# EAGLE design soar_demise (EAGLE 9.6.2)
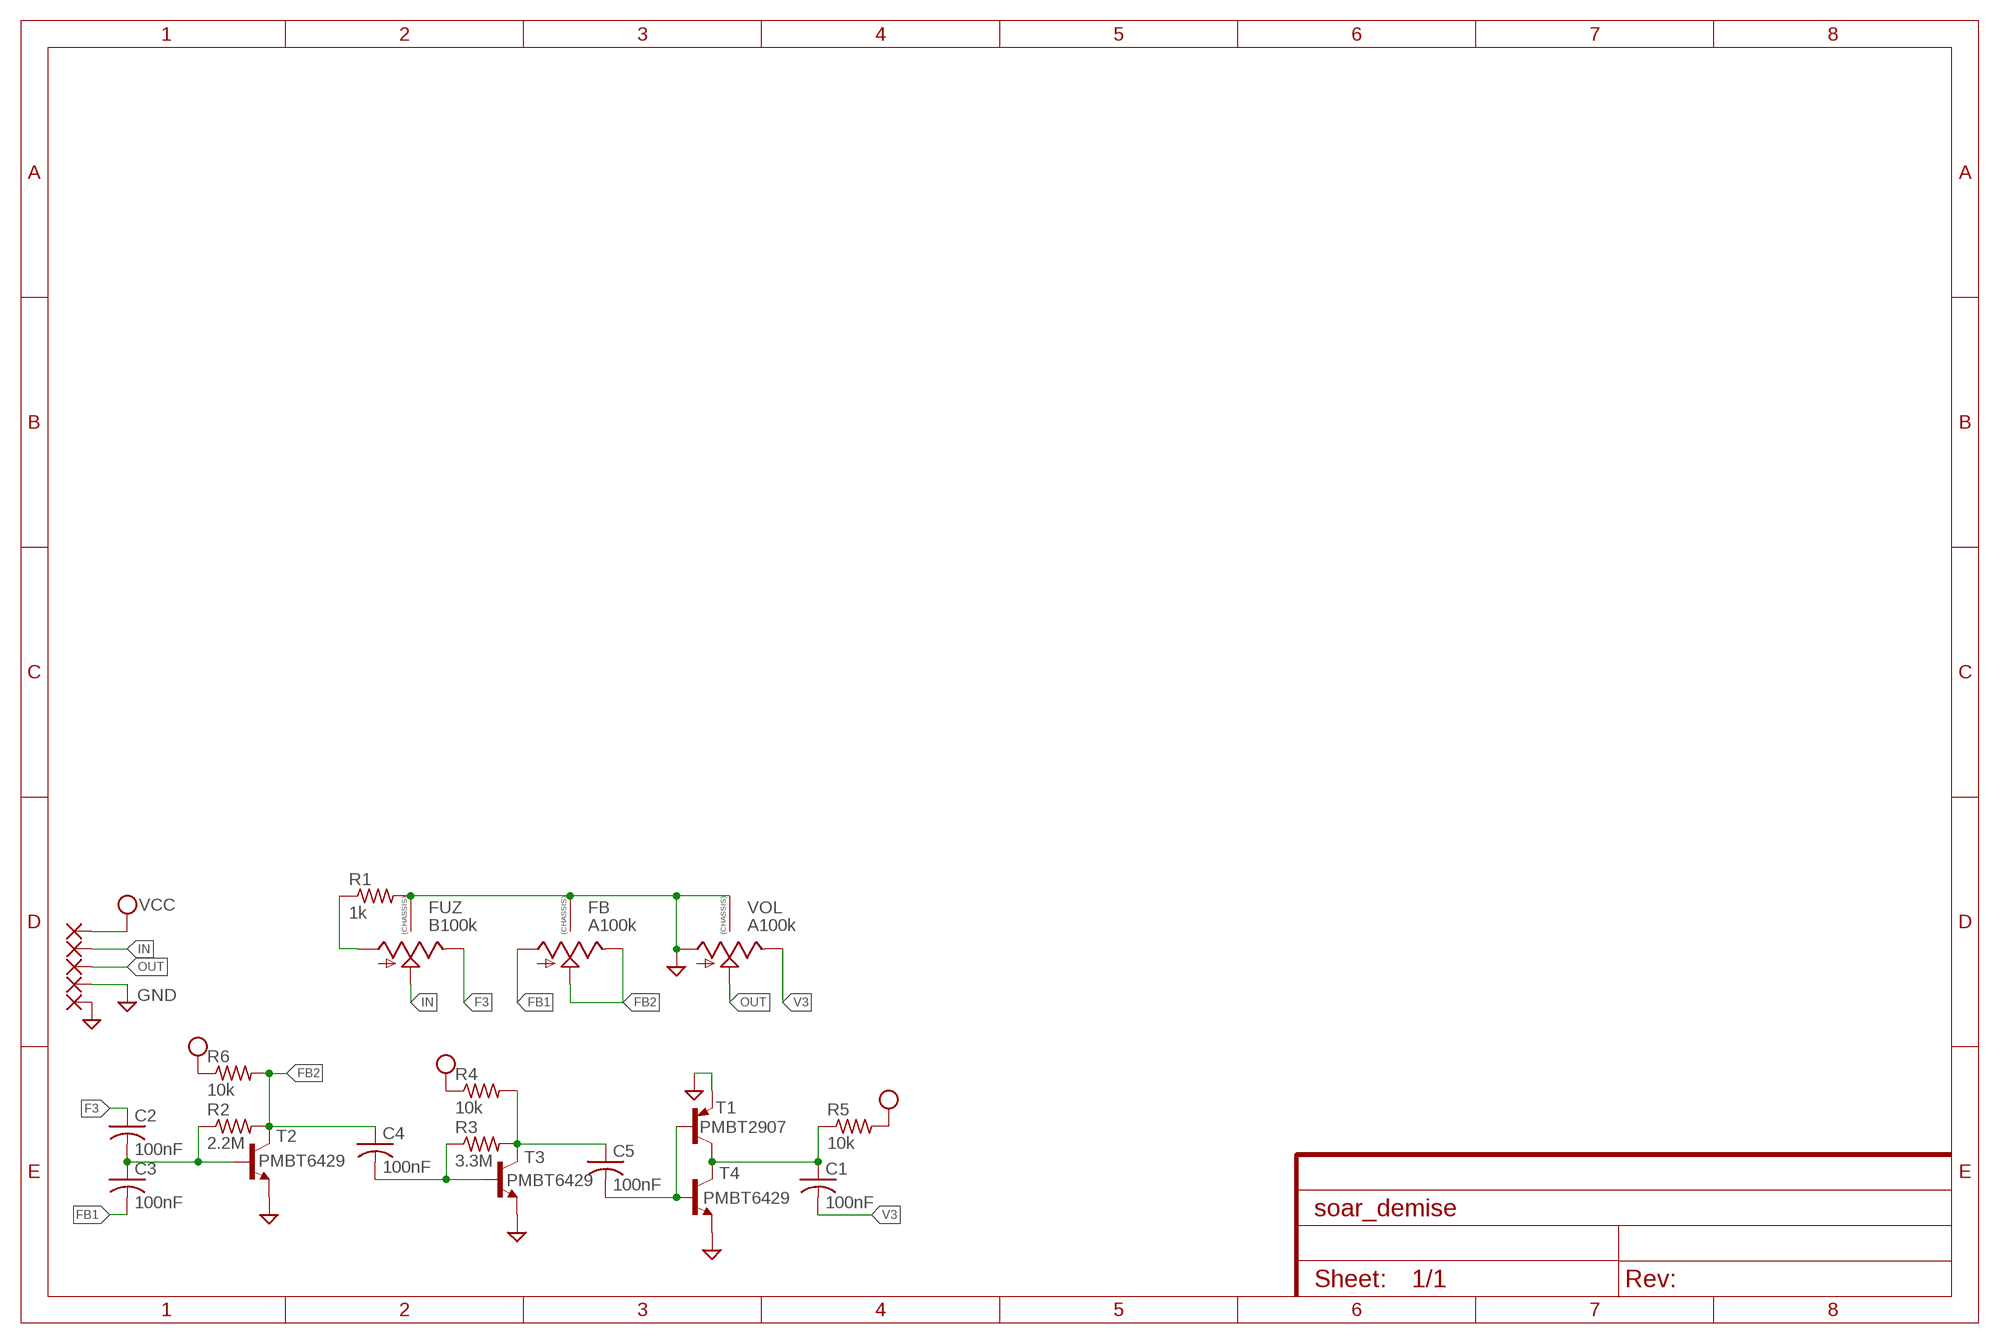
[diagram p0: schematic, sheet 1]

## Parts
C1  100nF  C-USC0805  [C0805]
C2  100nF  C-USC0805  [C0805]
C3  100nF  C-USC0805  [C0805]
C4  100nF  C-USC0805  [C0805]
C5  100nF  C-USC0805  [C0805]
FB  A100k  9MM_SNAP-IN_POT_CHASSIS  [9MM_SNAP-IN_POT]
FUZ  B100k  9MM_SNAP-IN_POT_CHASSIS  [9MM_SNAP-IN_POT]
PAD1  1,6/0,8  [1,6/0,8]
PAD2  1,6/0,8  [1,6/0,8]
PAD3  1,6/0,8  [1,6/0,8]
PAD4  1,6/0,8  [1,6/0,8]
PAD5  1,6/0,8  [1,6/0,8]
R1  1k  R-US_R0805  [R0805]
R2  2.2M  R-US_R0805  [R0805]
R3  3.3M  R-US_R0805  [R0805]
R4  10k  R-US_R0805  [R0805]
R5  10k  R-US_R0805  [R0805]
R6  10k  R-US_R0805  [R0805]
T1  PMBT2907  MMBT2907ALT1-PNP-SOT23-BEC  [SOT23-BEC]
T2  PMBT6429  MMBT6429LT1-NPN-SOT23-BEC  [SOT23-BEC]
T3  PMBT6429  MMBT6429LT1-NPN-SOT23-BEC  [SOT23-BEC]
T4  PMBT6429  MMBT6429LT1-NPN-SOT23-BEC  [SOT23-BEC]
VOL  A100k  9MM_SNAP-IN_POT_CHASSIS  [9MM_SNAP-IN_POT]

## Nets
F3: C2.1 FUZ.3(E)
FB1: C3.2 FB.1(A)
FB2: C4.1 FB.2(S) FB.3(E) R2.2 R6.2 T2.C
GND: FB.CHASSIS1 FB.CHASSIS2 FUZ.CHASSIS1 FUZ.CHASSIS2 PAD4.1(P) PAD5.1(P) R1.2 T1.E T2.E T3.E T4.E VOL.1(A) VOL.CHASSIS1 VOL.CHASSIS2
IN: FUZ.2(S) PAD2.1(P)
N$1: C1.1 R5.1 T1.C T4.C
N$2: C2.2 C3.1 R2.1 T2.B
N$3: C5.1 R3.2 R4.2 T3.C
N$4: FUZ.1(A) R1.1
N$5: C4.2 R3.1 T3.B
N$6: C5.2 T1.B T4.B
OUT: PAD3.1(P) VOL.2(S)
V3: C1.2 VOL.3(E)
VCC: PAD1.1(P) R4.1 R5.2 R6.1

## Library data of the parts
C1-C5 = adafruit:C-US: CAPACITOR, American symbol
FB FUZ VOL = MusicThingModular:9MM_SNAP-IN_POT_CHASSIS: 9mm vertical snap-in pot, Alpha / Panasonic style, with a connection to the metal chassis for grounding
PAD1-PAD5 = wirepad:1,6/0,8: THROUGH-HOLE PAD
R1-R6 = adafruit:R-US_: RESISTOR, American symbol
T1 = MusicThingModular:*-PNP-: PNP Transistror
T2-T4 = MusicThingModular:*-NPN-: NPN Transistror BF959 corrected 2008.03.06

## Board
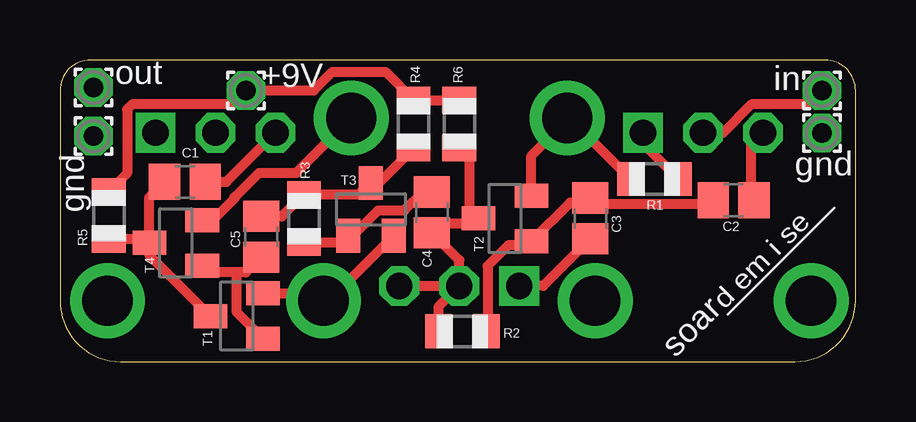
[diagram p1: board, top side]
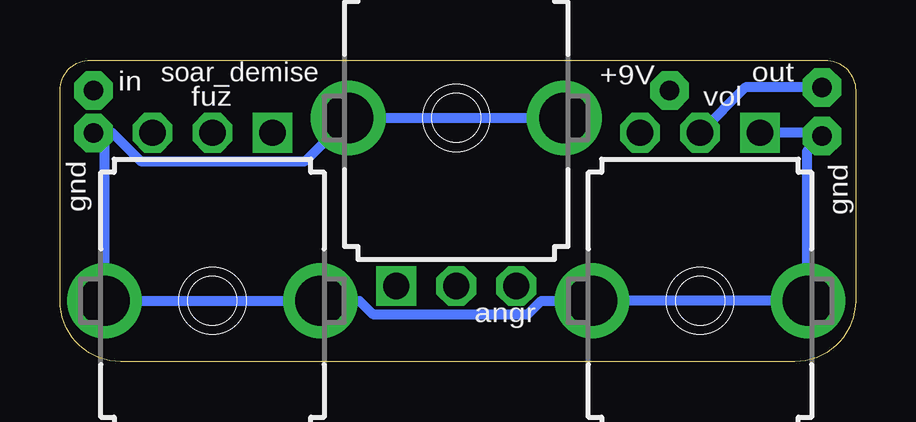
[diagram p2: board, bottom side, seen from below]

Size 33.15 x 12.57 mm. Coordinates in mm from the lower left corner, seen from the top.
Outline: 31.88,12.57 1.27,12.57 arc90 0,11.3 0,2.54 arc90 2.54,0 30.61,0 arc90 33.15,2.54 33.15,11.3 arc90 31.88,12.57
Copper layers (1*16): Top 0.035mm / dielectric 1.5mm / Bottom 0.035mm
Design rules "default *": minimum track width 6mil, minimum drill 0.35mm, track to track 6mil, track to pad 6mil, pad to pad 6mil, via to via 6mil, smd to smd 6mil, copper to edge 10mil, drill to drill 6mil, minimum pad ring 10mil, minimum via ring 8mil, stop-mask expansion 4mil, vias tented up to drill 0mil, thermal gap 10mil

### Footprints (pad centres in the part's own frame; a part is rotated, then mirrored left to right if it is on the bottom)
C0805 = smd 1.3 x 1.5: 1 -0.85,0; 2 0.85,0
9MM_SNAP-IN_POT = drill 1.1 square: 1 -2.5,-7 | drill 1.1 octagon: 2 0,-7; 3 2.5,-7 | drill 2.1 pad 2.794: CHASSIS1 -4.5,0; CHASSIS2 4.5,0
1,6/0,8 = drill 0.813 pad 1.6 octagon: 1 0,0
R0805 = smd 1.1 x 1.4: 1 -1,0; 2 1,0
SOT23-BEC = smd 1 x 1.4: B -0.95,-1.1; C 0,1.1; E 0.95,-1.1

### Placement (x,y rotation side)
C1  5.21,7.49 0 top
C2  28.07,6.73 180 top
C3  22.1,5.97 270 top
C4  15.49,6.22 90 top
C5  8.38,5.21 270 top
FB  16.64,10.16 0 bottom
FUZ  26.8,2.54 180 bottom
PAD1  7.75,11.3 0 top
PAD2  31.75,11.3 0 top
PAD3  1.4,11.43 0 top
PAD4  1.4,9.4 0 top
PAD5  31.75,9.53 0 top
R1  24.77,7.62 180 top
R2  16.76,1.27 180 top
R3  10.16,5.97 90 top
R4  14.73,9.91 270 top
R5  2.03,6.1 90 top
R6  16.64,9.91 270 top
T1  7.37,1.91 90 top
T2  18.54,5.97 90 top
T3  12.95,6.35 0 top
T4  4.83,4.95 90 top
VOL  6.48,2.54 180 bottom

### Tracks (layer width: path | path; a pad name or v marks a point on that pad's centre or on a via)
F3
  Top 0.406: C2.1 28.79,6.86 28.79,9.03 FUZ.3
FB1
  Top 0.406: C3.2 20.14,3.16 FB.1
FB2
  Top 0.406: FB.2 15.76,2.29 R2.2 | FB.2 16.64,4.23 C4.1 15.88,5.75 17.44,5.75 T2.C 17.06,6.35 17.06,8.48 R6.2 | FB.3 FB.2
GND
  Top 0.406: R1.2 21.23,10.16 | 21.23,10.16 FB.CHASSIS1 | T2.E 19.64,8.58 21.23,10.16 | T1.E 10.66,2.85 VOL.CHASSIS2 11.19,2.54 T3.E | FB.CHASSIS2 9.85,7.88 8.3,7.88 7.28,6.85 7.28,6.81 6.37,5.9 T4.E
  Bottom 0.406: VOL.1 1.54,9.54 PAD4.1 2.03,8.76 2.03,2.54 | VOL.CHASSIS1 2.03,2.54 | 2.03,2.54 VOL.CHASSIS2 13.09,2.54 13.65,1.98 20.11,1.98 20.67,2.54 FUZ.CHASSIS1 FUZ.CHASSIS2 31.3,9.07 PAD5.1 30.95,9.53 29.79,8.36 22.94,8.36 FB.CHASSIS1 FB.CHASSIS2
IN
  Top 0.406: PAD2.1 31.17,10.72 28.81,10.72 27.63,9.54 FUZ.2
N$1
  Top 0.406: T1.C 3.73,4.45 T4.C | T4.C 3.58,5.1 R5.1 | T4.C 3.73,6.86 C1.1
N$2
  Top 0.406: R2.1 17.82,1.32 17.82,3.99 18.67,4.85 19.6,4.85 19.64,4.89 T2.B 21.26,6.63 21.66,6.63 21.84,6.82 C3.1 22.48,6.82 22.73,6.56 26.84,6.56 27.01,6.73 C2.2
N$3
  Top 0.406: 12.79,7.28 12.47,6.97 R3.2 9.25,6.06 C5.1 | 12.79,7.28 T3.C | R4.2 13.11,7.28 12.79,7.28
N$4
  Top 0.406: R1.1 24.3,9.09 FUZ.1
N$5
  Top 0.406: R3.1 11.72,4.97 T3.B 12.2,5.25 13.26,6.31 14.35,6.31 15.11,7.07 C4.2
N$6
  Top 0.406: T4.B 6.21,3.72 7.37,3.72 | T1.B 7.37,2.06 7.37,3.72 | C5.2 7.75,3.72 7.37,3.72
OUT
  Bottom 0.406: PAD3.1 4.59,11.43 VOL.2
V3
  Top 0.406: C1.2 6.93,7.49 VOL.3
VCC
  Top 0.406: R5.2 2.8,7.86 2.8,10.51 3,10.72 7.17,10.72 PAD1.1 10.57,11.3 11.34,12.07 13.56,12.07 R4.1 R6.1

### Text on the board
tPlace: out | +9V | in | gnd | gnd | d em i se | soar________
bPlace: out | +9V | soar_demise | vol | fuz | in | gnd | gnd | angr